# Altium project Embedded_System.PrjPcb
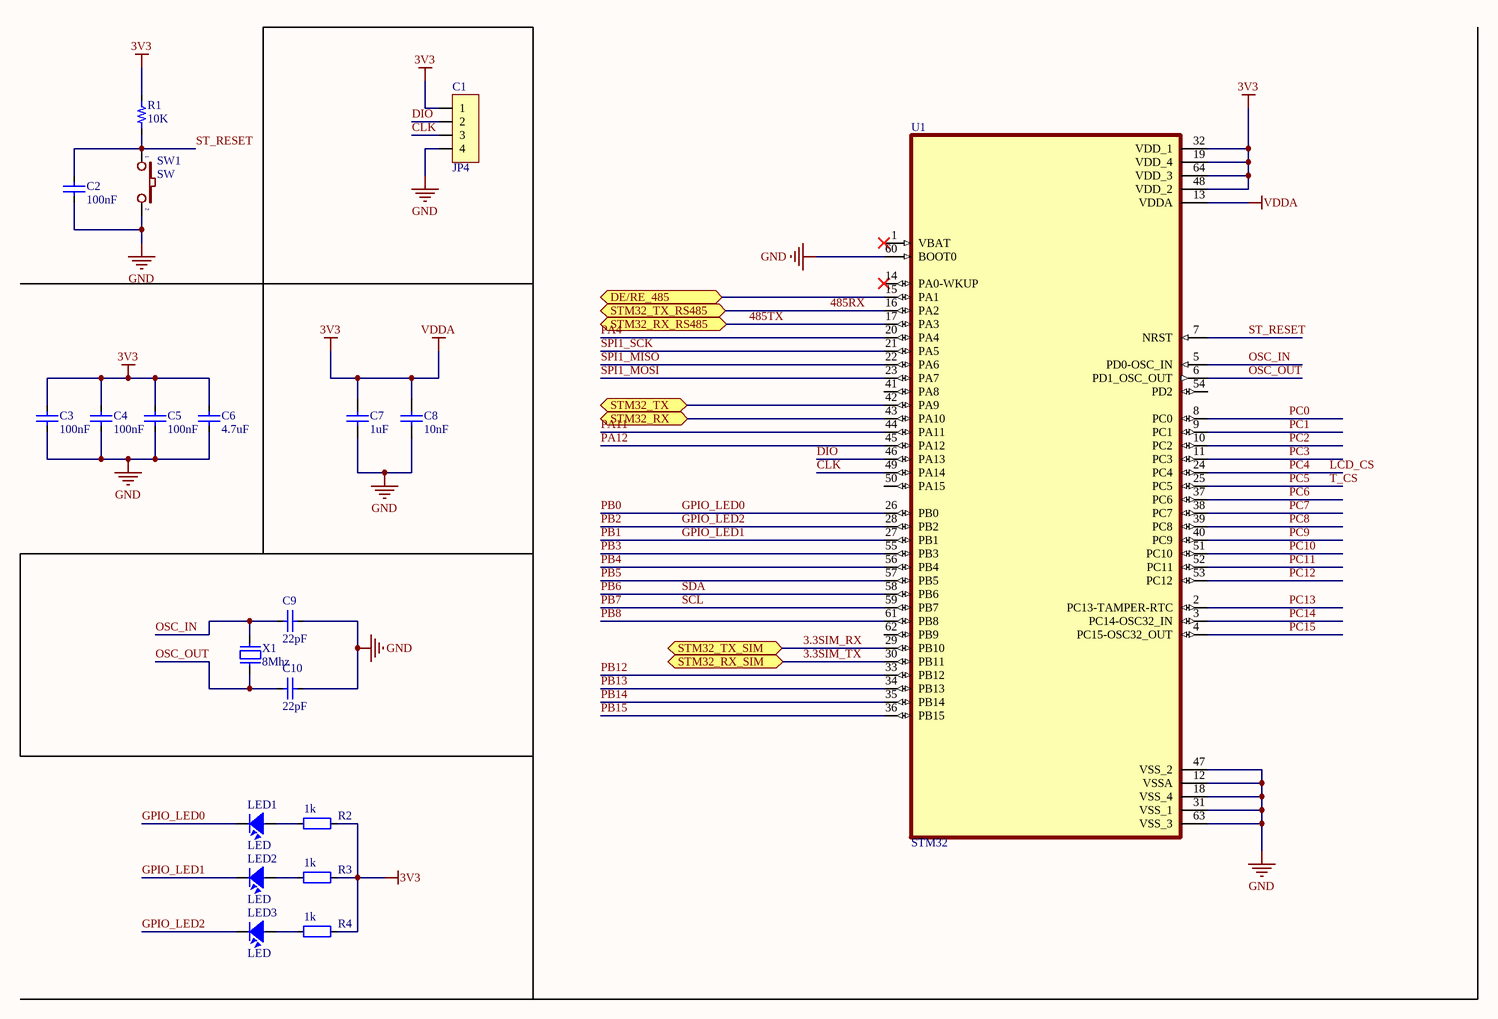
[diagram p0: STM32.SchDoc]
6 sheets, 109 parts. Net scope: flat (ports and power ports of the same name join across sheets).
Board file: Main.PcbDoc
Sheets:
  STM32.SchDoc
  POWER.SchDoc
  4G.SchDoc
  RS485.SchDoc
  LCD.SchDoc
  Sensor.SchDoc

## Sheet STM32.SchDoc
size A3; SheetNumber: 1; SheetTotal: 6

### Parts
C1  JP4  [JP4-C1T]
C2  100nF  [CAP_0805]
C3  100nF  [CAP_0805]
C4  100nF  [CAP_0805]
C5  100nF  [CAP_0805]
C6  4.7uF  [CAP_0805]
C7  1uF  [CAP_0805]
C8  10nF  [CAP_0805]
C9  22pF  [CAP_0805]
C10  22pF  [CAP_0805]
LED1  LED  [LED-0805-Red]
LED2  LED  [LED-0805-Green]
LED3  LED  [LED-0805-Blue]
R1  10K  [RES-SMD-0101]
R2  1k  [RES-SMD-0805]
R3  1k  [RES-SMD-0805]
R4  1k  [RES-SMD-0805]
SW1  SW  [SW2]
U1  STM32  [LQFP 64]
X1  8Mhz  [XT2]

### Ports
DE/RE_485 (bidir), STM32_RX (bidir), STM32_RX_RS485 (bidir), STM32_RX_SIM (bidir), STM32_TX (bidir), STM32_TX_RS485 (bidir), STM32_TX_SIM (bidir)

### Nets
3V3: C1.1 C3.2 C4.2 C5.2 C6.2 C7.2 C8.2 R1.1 R2.1 R3.1 R4.1 U1.13(VDDA) U1.19(VDD_4) U1.32(VDD_1) U1.48(VDD_2) U1.64(VDD_3)  [also labelled VDDA]
GND: C1.4 C2.2 C3.1 C4.1 C5.1 C6.1 C7.1 C8.1 C9.1 C10.1 SW1.2 U1.12(VSSA) U1.18(VSS_4) U1.31(VSS_1) U1.47(VSS_2) U1.60(BOOT0) U1.63(VSS_3)
3.3SIM_RX: U1.29(PB10) ; port STM32_TX_SIM
3.3SIM_TX: U1.30(PB11) ; port STM32_RX_SIM
485RX: U1.16(PA2) ; port STM32_TX_RS485
485TX: U1.17(PA3) ; port STM32_RX_RS485
CLK: C1.3 U1.49(PA14)
DIO: C1.2 U1.46(PA13)
GPIO_LED0: LED1.2 U1.26(PB0)  [also labelled PB0]
GPIO_LED1: LED2.2 U1.27(PB1)  [also labelled PB1]
GPIO_LED2: LED3.2 U1.28(PB2)  [also labelled PB2]
LCD_CS: U1.24(PC4)  [also labelled PC4]
OSC_IN: C9.2 U1.5(PD0-OSC_IN) X1.2
OSC_OUT: C10.2 U1.6(PD1_OSC_OUT) X1.1
PA4: U1.20(PA4)
PA11: U1.44(PA11)
PA12: U1.45(PA12)
PB3: U1.55(PB3)
PB4: U1.56(PB4)
PB5: U1.57(PB5)
PB6: U1.58(PB6)  [also labelled SDA]
PB7: U1.59(PB7)  [also labelled SCL]
PB8: U1.61(PB8)
PB12: U1.33(PB12)
PB13: U1.34(PB13)
PB14: U1.35(PB14)
PB15: U1.36(PB15)
PC0: U1.8(PC0)
PC1: U1.9(PC1)
PC2: U1.10(PC2)
PC3: U1.11(PC3)
PC5: U1.25(PC5)  [also labelled T_CS]
PC6: U1.37(PC6)
PC7: U1.38(PC7)
PC8: U1.39(PC8)
PC9: U1.40(PC9)
PC10: U1.51(PC10)
PC11: U1.52(PC11)
PC12: U1.53(PC12)
PC13: U1.2(PC13-TAMPER-RTC)
PC14: U1.3(PC14-OSC32_IN)
PC15: U1.4(PC15-OSC32_OUT)
SPI1_MISO: U1.22(PA6)
SPI1_MOSI: U1.23(PA7)
SPI1_SCK: U1.21(PA5)
ST_RESET: C2.1 R1.2 SW1.1 U1.7(NRST)
NetLED1_1: LED1.1 R2.2
NetLED2_1: LED2.1 R3.2
NetLED3_1: LED3.1 R4.2
NetU1_15: U1.15(PA1) ; port DE/RE_485
NetU1_42: U1.42(PA9) ; port STM32_TX
NetU1_43: U1.43(PA10) ; port STM32_RX

Not connected (* = marked no-connect by the designer): U1 1(VBAT)* 14(PA0-WKUP)* 41(PA8) 50(PA15) 54(PD2) 62(PB9)

### Library data of the parts
C1 = JP4: WR-PHD 2.54 mm Angled Socket Header; Manufacturer: W¨¹rth Elektronik eiSos GmbH; partNo: 613004143121; ComponentLink1 Description: Manufacturer; ComponentLink2 Description: Datasheet; NoPins: 04; Created Date: 29 March 2013; ComponentLink1URL: http://www.we-online.com; ComponentLink2URL: http://katalog.we-online.de/em/datasheet/6130xx143121.pdf; Created by: Karrer Zheng
C2-C10 = CapSMD: Capacitor; Value: 33p; Published: 8-Jun-2000; LatestRevisionDate: 17-Jul-2002; LatestRevisionNote: Re-released for DXP Platform.; PackageReference: RAD-0.3; Publisher: Altium Limited
LED1-LED3 = LED: LED Single colour Green and Red; Value: LED 3 ly Single Colour
R1-R4 = Resistor - SMD: Resistor; Manufacturer: Generic Components; Class: Passive; Published: 08/06/2000; Publisher: Altium Hobart Technology Centre
SW1 = SW2: Switch button 2 pin; Value: SW chip 2 pin
U1 = STM32F103RCT6: STM32 ARM-based 32-bit MCU 72MHz 256KB
X1 = XT2: Crystal For all Crystal 2pin.; Value: 4Mhz

## Sheet POWER.SchDoc
size A3; SheetNumber: 2; SheetTotal: 6
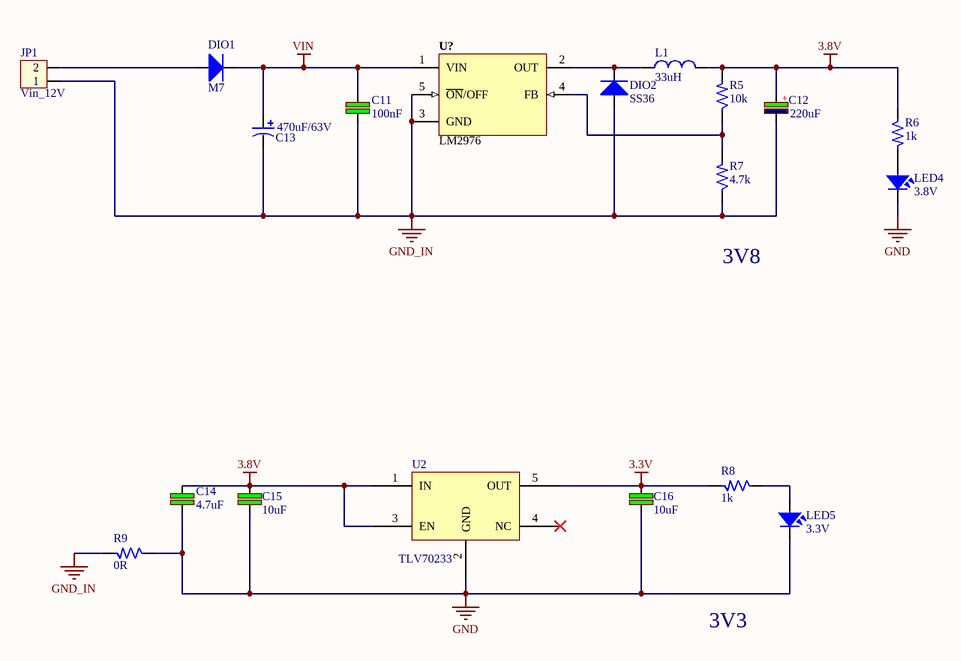
[diagram p1: POWER.SchDoc]

### Parts
C11  value 100nF  [C-0805]  (hidden comment: 4.7uF)
C12  220uF  [EEFSDE]
C13  470uF/63V  [CAP_7343]
C14  4.7uF  [C-0805]
C15  10uF  [C-0805]
C16  10uF  [C-0805]
DIO1  M7  [DIO-214AC(SMA)]
DIO2  SS36  [DIO-214AC(SMA)]
JP1  Vin_12V  [KF2-5.08]
L1  33uH  [L-SMD-M-7.3x4.5]
LED4  3.8V  [LED-0805-Blue]
LED5  3.3V  [LED-0805-Blue]
R5  10k  [R-0805]
R6  1k  [R-0805]
R7  4.7k  [R-0805]
R8  1k  [R-0805]
R9  0R  [R-0805]
U2  Name: TLV70233  [SOT23-5]  (hidden comment: TLV70223)
U?  LM2976  [TO263-5]

### Nets
3.3V: C16.1 R8.2 U2.5(OUT)  [project net +3.3V]
3.8V: C12.1 C14.2 C15.1 L1.2 R5.2 R6.1 U2.1(IN) U2.3(EN)
GND: C14.1 C15.2 C16.2 LED4.2 LED5.2 R9.1 U2.2(GND)
GND_IN: C11.1 C12.2 C13.2 DIO2.1(A) JP1.1 R7.1 R9.2 U?.3(GND) U?.5(~{ON}/OFF)
VIN: C11.2 C13.1 DIO1.2(K) U?.1(VIN)
NetDIO1_1: DIO1.1(A) JP1.2
NetDIO2_2: DIO2.2(K) L1.1 U?.2(OUT)
NetLED4_1: LED4.1 R6.2
NetLED5_1: LED5.1 R8.1
NetR5_1: R5.1 R7.2 U?.4(FB)

Not connected (* = marked no-connect by the designer): U2 4(NC)*

### Notes on the sheet
- 3V8
- 3V3
- (in symbol CP5) +

### Library data of the parts
C11 C14 = C: 4.7µF ±10% 35V Ceramic Capacitor X5R 0805 (2012 Metric); Manufacturer: Samsung Electro-Mechanics; Part number: CL21A475KLCLQNC; User_Description: CAP CER 4.7UF 35V X5R 0805; Category: CAPACITOR; Package: 0805
  C14: Value: 4.7uF
C12 = CP5: 220µF Molded Tantalum Polymer Capacitor 16V 2917 (7343 Metric) 40mOhm @ 100kHz; Manufacturer: AVX Corporation; Part number: TCME227M016R0040E; User_Description: CAP TANT POLY 220UF 16V 2917; Value: 220uF; Category: CAPACITOR; Package: 2917
C13 = CAP_TAN_SMD: Polazied Tantalum Capacitor
C15 C16 = C: Cap SMD; Manufacturer: Samsung Electro-Mechanics; Part number: CL21A106KPFNNNG; User_Description: CAP CER 10UF 10V X5R 0805; Value: 10uF; Category: CAPACITOR; Package: 0805
DIO1 DIO2 = Diode SMD: Default Diode; Code - JEDEC: DO-214-AB; Value: 1N5007; Published: 8-Jun-2000; Revision: July-2002: Re-released for DXP Platform.; Publisher: Altium Limited
JP1 = Con2: Connector 2; Value: Connector 2
L1 = Inductor: https://linhkien.cxt.vn/6932-cuon-cam-cd74-cac-gia-tri.html; Value: 150 mH
LED4 LED5 = LED: as LED1 on sheet STM32
R5 = R: RES SMD 10K OHM 1% 1/8W 0805; Manufacturer: Yageo; Part number: RC0805FR-0710KL; Category: RESISTORS; Package: 0805; User_Description: RES SMD 10K OHM 1% 1/8W 0805; Value: 10k
R6 R8 = R: Resistor 1/4W; Manufacturer: Yageo; Part number: RC0805FR-071KL; User_Description: RES SMD 1K OHM 1% 1/8W 0805; Value: 1k; Category: RESISTORS; Package: 0805
R7 = R: RES SMD 3.3K OHM 1% 1/8W 0805; Manufacturer: Yageo; Part number: RC0805FR-073K3L; Category: RESISTORS; Package: 0805; User_Description: RES SMD 3.3K OHM 1% 1/8W 0805; Value: 3.3k
R9 = R: Resistor 1/4W; Manufacturer: Yageo; Part number: RC0805FR-071KL; Value: 1k; User_Description: RES SMD 1K OHM 1% 1/8W 0805; Category: RESISTORS; Package: 0805
U2 = TLV70223: IC æn ¸p TLV70233, d¸n; Package: SOT23-5
U? = LM2596: Max Input Voltage: 12 V; Max Output Current: 3 (6.0 peak) A; Max Output Voltage: mV; Category: IC-Power; Min Input Voltage: mV; Min Output Voltage: mV; Mounting Technology: Surface Mount; Status: Unreleased; Supply Voltage: mV; Temperature Range: -40 to +125 degC

## Sheet 4G.SchDoc
size A3; SheetNumber: 3; SheetTotal: 6
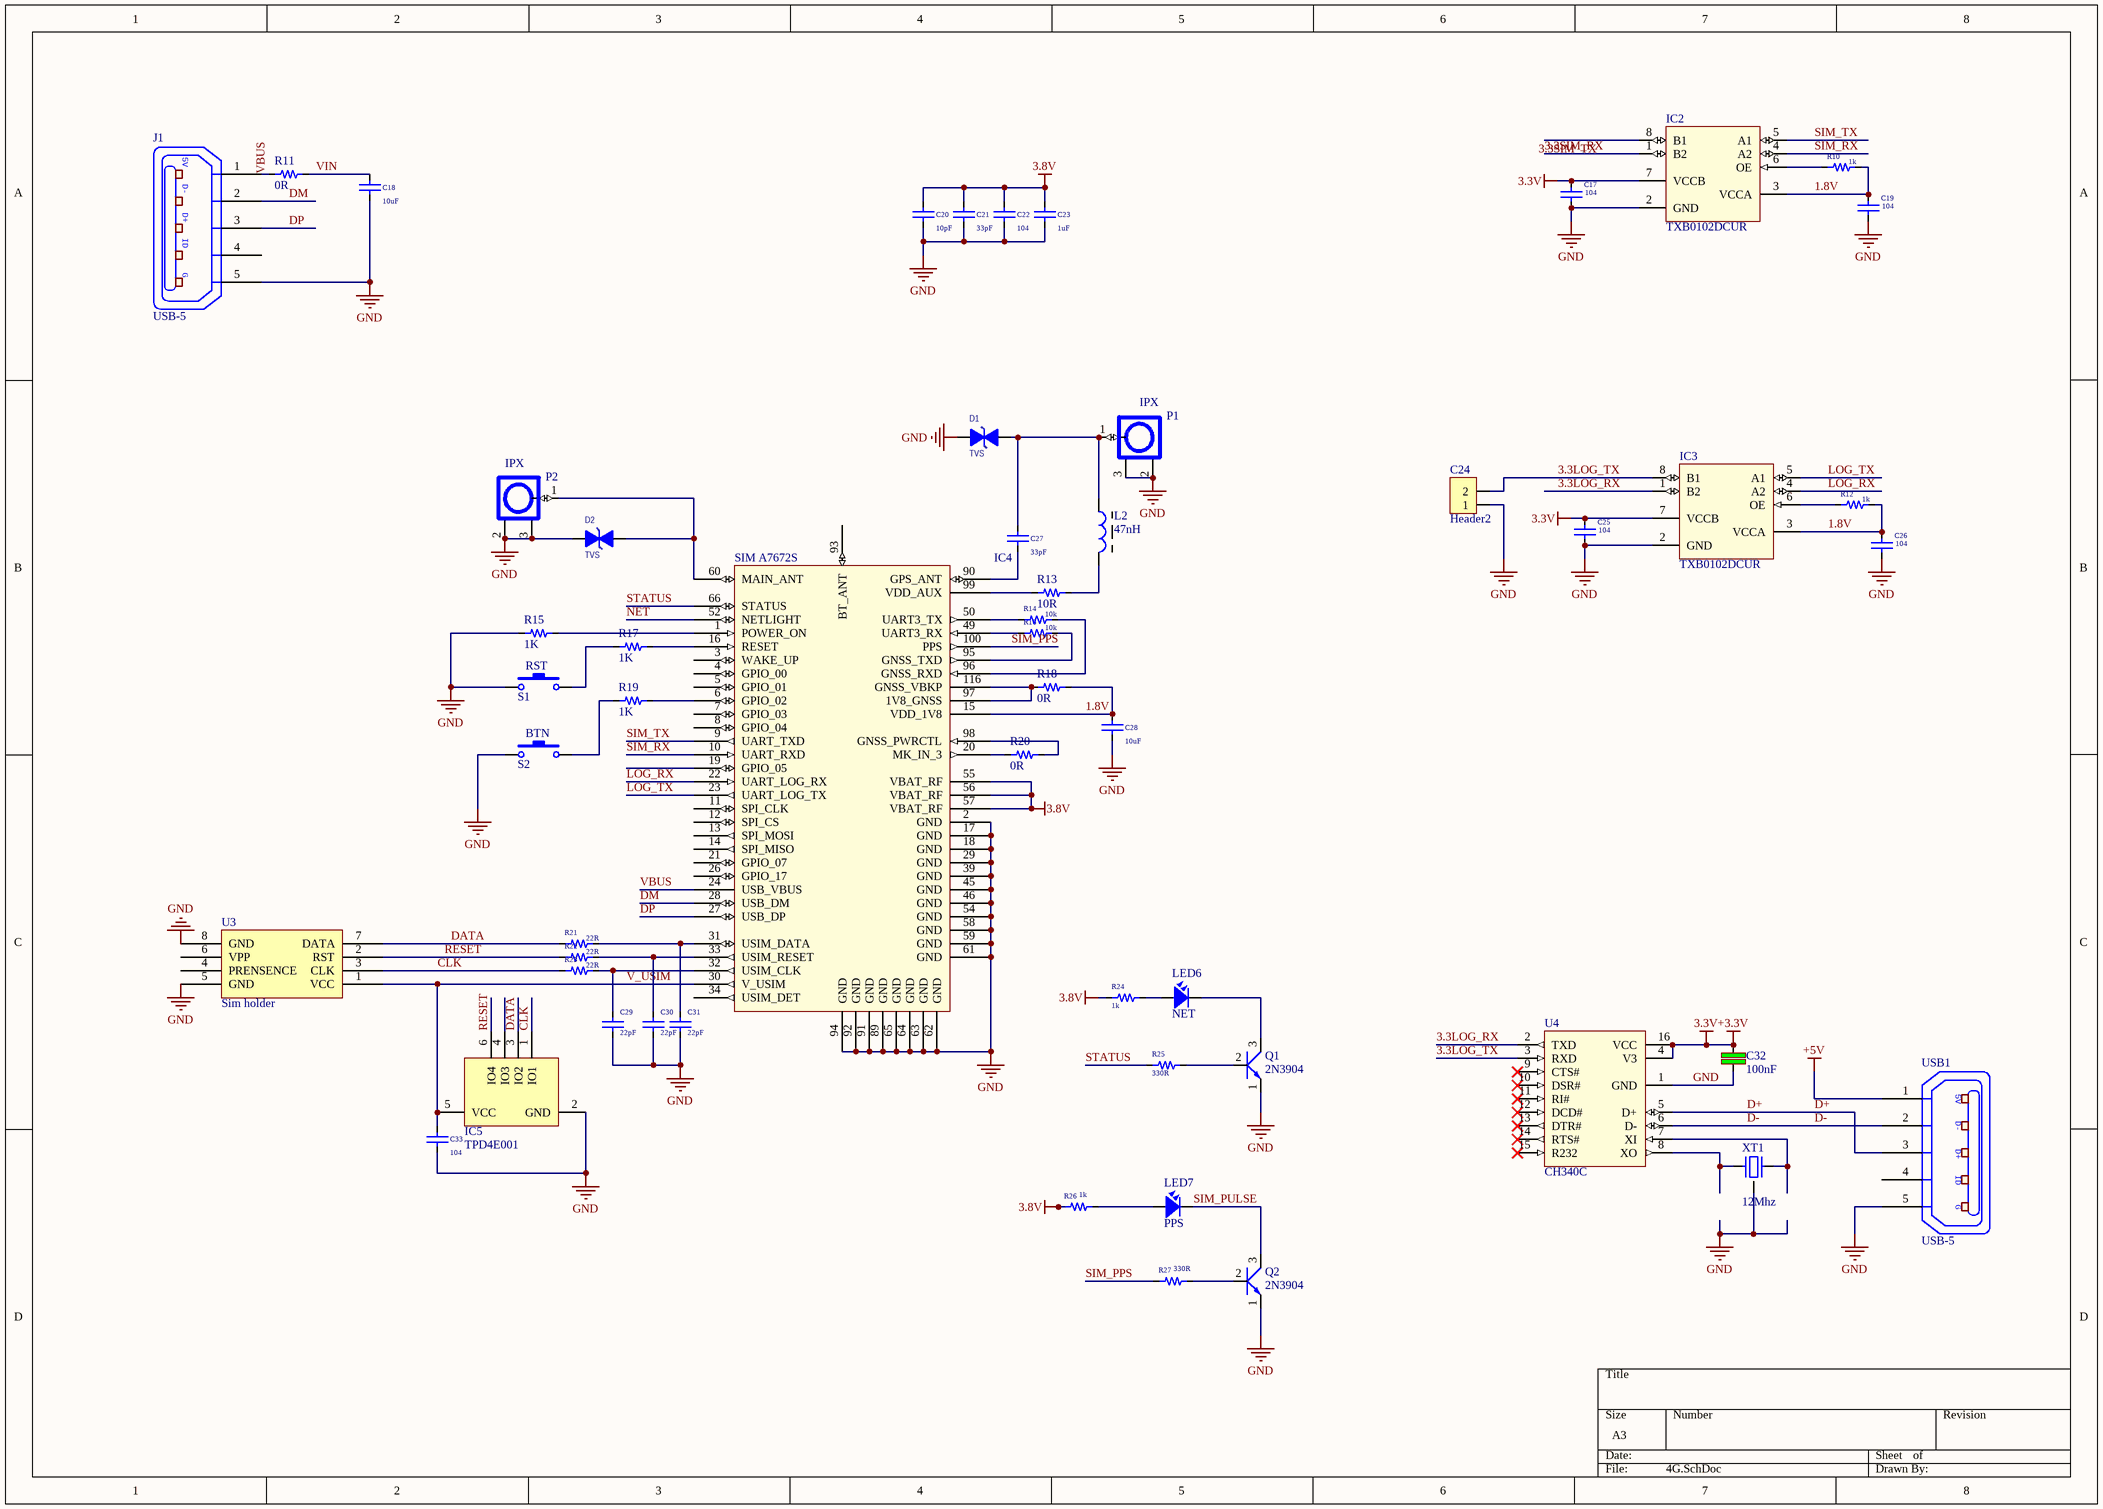
[diagram p2: 4G.SchDoc]

### Parts
C17  104  [CAP_0603]
C18  10uF  [CAP_0603]
C19  104  [CAP_0603]
C20  10pF  [CAP_0603]
C21  33pF  [CAP_0603]
C22  104  [CAP_0603]
C23  1uF  [CAP_0603]
C24  Header2  [JP2]
C25  104  [CAP_0603]
C26  104  [CAP_0603]
C27  33pF  [CAP_0603]
C28  10uF  [CAP_0603]
C29  22pF  [CAP_0603]
C30  22pF  [CAP_0603]
C31  22pF  [CAP_0603]
C32  100nF  [C-0805]
C33  104  [CAP_0603]
D1  TVS  [RES-SMD-0402]
D2  TVS  [RES-SMD-0402]
IC2  TXB0102DCUR  [TXB0102DCUR]
IC3  TXB0102DCUR  [TXB0102DCUR]
IC4  SIM A7672S  [A7672S]
IC5  TPD4E001  [TPD4E001]
J1  USB-5  [USB-M1]
L2  47nH  [RES-SMD-0603]
LED6  NET  [LED-0805-Blue]
LED7  PPS  [LED-0805-Blue]
P1  IPX  [IPXS]
P2  IPX  [IPXS]
Q1  2N3904  [SOT23C]
Q2  2N3904  [SOT23C]
R10  1k  [RES-SMD-0603]
R11  0R  [RES-SMD-0603]
R12  1k  [RES-SMD-0603]
R13  10R  [RES-SMD-0603]
R14  10k  [RES-SMD-0603]
R15  1K  [RES-SMD-0603]
R16  10k  [RES-SMD-0603]
R17  1K  [RES-SMD-0603]
R18  0R  [RES-SMD-0603]
R19  1K  [RES-SMD-0603]
R20  0R  [RES-SMD-0603]
R21  22R  [RES-SMD-0603]
R22  22R  [RES-SMD-0603]
R23  22R  [RES-SMD-0603]
R24  1k  [RES-SMD-0603]
R25  330R  [RES-SMD-0603]
R26  1k  [RES-SMD-0603]
R27  330R  [RES-SMD-0603]
S1  RST  [SW-SMD]
S2  BTN  [SW-SMD]
U3  Sim holder  [sim_holder_micro]
U4  CH340C  [SOP-16]
USB1  USB-5  [USB-M1]
XT1  12Mhz  [XT32-3]

### Nets
3.8V: C20.2 C21.2 C22.2 C23.2 IC4.55(VBAT_RF) IC4.56(VBAT_RF) IC4.57(VBAT_RF) R24.2 R26.2
+3.3V: C17.2 C25.2 C32.2 IC2.7(VCCB) IC3.7(VCCB) U4.4(V3) U4.16(VCC)  [also labelled 3.3V]
+5V: USB1.1(P1)
GND: C17.1 C18.1 C19.1 C20.1 C21.1 C22.1 C23.1 C24.1 C25.1 C26.1 C28.1 C29.1 C30.1 C31.1 C32.1 C33.1 D1.2(K) D2.2(K) IC2.2(GND) IC3.2(GND) IC4.2(GND) IC4.17(GND) IC4.18(GND) IC4.29(KEYPAD_0) IC4.39(GND) IC4.45(GND) IC4.46(ADC2) IC4.54(GPIO4) IC4.58(GND) IC4.59(GND) IC4.61(GND) IC4.62(GND) IC4.63(GND) IC4.64(GND) IC4.65(GND) IC4.89(GND) IC4.91(GND) IC4.92(GND) IC4.94(GND) IC5.2(GND) J1.5(P5) P1.2 P1.3 P2.2 P2.3 Q1.1(E) Q2.1(E) R15.1 S1.1 S2.1 U3.5(GND) U3.8(GND) U4.1(GND) USB1.5(P5) XT1.3
1.8V: C19.2 C26.2 C28.2 IC2.3(VCCA) IC3.3(VCCA) IC4.15(RESERVED) R10.1 R12.1 R18.2
3.3LOG_RX: IC3.1(B2) U4.2(TXD)
3.3LOG_TX: C24.2 IC3.8(B1) U4.3(RXD)
3.3SIM_RX: IC2.1(B2)
3.3SIM_TX: IC2.8(B1)
CLK: IC5.1(IO1) R23.2 U3.3(CLK)
D+: U4.5(D+) USB1.3(P3)
D-: U4.6(D-) USB1.2(P2)
DATA: IC5.3(IO2) R21.2 U3.7(DATA)
DM: IC4.28(KEYSENSE_N0) J1.2(P2)
DP: IC4.27(KEYSENSE_N1) J1.3(P3)
LOG_RX: IC3.4(A2) IC4.22(SPK_P)
LOG_TX: IC3.5(A1) IC4.23(MIC1P)
NET: IC4.52(GPIO41)
RESET: IC5.6(IO4) R22.2 U3.2(RST)
SIM_PPS: IC4.100(PPS) R27.2
SIM_PULSE: LED7.2 Q2.3(C)
SIM_RX: IC2.4(A2) IC4.10(UART_RXD)
SIM_TX: IC2.5(A1) IC4.9(UART_TXD)
STATUS: IC4.66(STATUS) R25.2
V_USIM: C33.2 IC4.30(KEYPAD_2) IC5.5(VCC) U3.1(VCC)
VBUS: IC4.24(MIC1N) J1.1(P1) R11.1
VIN: C18.2 R11.2
NetC27_1: C27.1 IC4.90(GPS_ANT)
NetC27_2: C27.2 D1.1(A) L2.1 P1.1
NetC29_2: C29.2 IC4.32(KEYSENSE_N3) R23.1
NetC30_2: C30.2 IC4.33(KEYPAD_1) R22.1
NetC31_2: C31.2 IC4.31(KEYSENSE_N2) R21.1
NetD2_1: D2.1(A) IC4.60(MAIN_ANT) P2.1
NetIC2_6: IC2.6(OE) R10.2
NetIC3_6: IC3.6(OE) R12.2
NetIC4_1: IC4.1(POWER_ON) R15.2
NetIC4_6: IC4.6(GPIO_02) R19.1
NetIC4_16: IC4.16(RESERVED) R17.2
NetIC4_20: IC4.20(MK_IN_3) R20.1
NetIC4_49: IC4.49(GPIO40) R16.2
NetIC4_50: IC4.50(GPIO43) R14.2
NetIC4_95: IC4.95(GNSS_TXD) R16.1
NetIC4_96: IC4.96(GNSS_RXD) R14.1
NetIC4_97: IC4.97(1V8_GNSS) IC4.116(GNSS_VBKP) R18.1
NetIC4_98: IC4.98(GNSS_PWRCTL) R20.2
NetIC4_99: IC4.99(VDD_AUX) R13.1
NetL2_2: L2.2 R13.2
NetLED6_1: LED6.1 R24.1
NetLED6_2: LED6.2 Q1.3(C)
NetLED7_1: LED7.1 R26.1
NetQ1_2: Q1.2(B) R25.1
NetQ2_2: Q2.2(B) R27.1
NetR17_1: R17.1 S1.2
NetR19_2: R19.2 S2.2
NetU4_7: U4.7(XI) XT1.2
NetU4_8: U4.8(XO) XT1.1

Not connected (* = marked no-connect by the designer): IC4 3(WAKE_UP) 4(GPIO_00) 5(GPIO_01) 7(GPIO_03) 8(GPIO_04) 11(SPI_CLK) 12(SPI_CS) 13(SPI_MOSI) 14(SPI_MISO) 19(GPIO_05) 21(SPK_M) 25(EAR1N) 26(EAR1P) 34(KEYPAD_4) 35(KEYPAD_3) 36(KEYSENSE_N4) 47(ADC1) 48(GPIO44) 51(GPIO1) 53(GPIO42) 73(PCM_DOUT) 74(PCM_DIN) 75(PCM_SYNC) 76(PCM_CLK) 93(BT_ANT); IC5 4(IO3); J1 4(P4); U3 4(PRENSENCE) 6(VPP); U4 9(CTS#)* 10(DSR#)* 11(RI#)* 12(DCD#)* 13(DTR#)* 14(RTS#)* 15(R232)*; USB1 4(P4)

### Notes on the sheet
- (in symbol USB-5) 5V; D-; D+; ID; G

### Library data of the parts
C17-C23 C25-C31 C33 = CapSMD: Capacitor; Value: 33p; Published: 8-Jun-2000; LatestRevisionDate: 17-Jul-2002; LatestRevisionNote: Re-released for DXP Platform.; PackageReference: RAD-0.3; Publisher: Altium Limited
C24 = Header2: Header IDC, 2 x 1 Pin Vertical 2.54mm Pitch (Non-Boxed, Male); Manufacturer: W¨¹rth Elektronik eiSos GmbH; partNo: 613002143121; ComponentLink1 Description: Manufacturer; ComponentLink2 Description: Datasheet; NoPins: 02; Created Date: 29 March 2013; ComponentLink1URL: http://www.we-online.com; ComponentLink2URL: http://katalog.we-online.de/em/datasheet/6130xx143121.pdf; Created by: Karrer Zheng
C32 = C: Cap SMD; Manufacturer: Samsung Electro-Mechanics; Part number: CL21B104KBCNNWC; User_Description: CAP CER 0.1UF 50V X7R 0805; Value: 100nF; Category: CAPACITOR; Package: 0805
D1 D2 = TVS: TVS DIODE 4VWM 1005; Manufacturer: Murata Electronics; Part number: LXES15AAA1-153; Value: 4V; Category: Circuit Protection; Package: 0402; User_Description: TVS DIODE 4VWM 1005
IC2 IC3 = TXB0102DCUR: IC TRNSLTR BIDIRECTIONAL US8; Manufacturer: Texas Instruments; Category: IC Logic Level; Package: 8-VSSOP; Part number: TXB0102DCUR; User_Description: IC TRNSLTR BIDIRECTIONAL US8
IC4 = SIM A7672S: SIM A7672S-CAT-M1; Part number: SIM A7672S
IC5 = TPD4E001_1: Manufacturer: Texas Instruments; Part number: TPD4E001RDBVR; User_Description: TVS DIODE 5.5VWM SC70-6; Category: Circuit Protection; Package: SOT-363
J1 USB1 = USB-5: Manufacturer: FCI; Category: Connectors, Interconnects
L2 = Inductor Ferit: FIXED IND 47NH 300MA 700MOHM SMD; Manufacturer: Taiyo Yuden; Part number: HK160847NJ-T; Value: 150 mH; Category: INDUCTORS; Package: 0603; User_Description: FIXED IND 47NH 300MA 700MOHM SMD
LED6 LED7 = LED: as LED1 on sheet STM32
P1 P2 = IPXSx66: Antenna GSM GPS; Manufacturer: TE Connectivity AMP Connectors; Part number: 2334884-1; User_Description: UMCC MICRO-COAX RECEPTACLE, GEN; Category: Connectors; Package: SMD
Q1 Q2 = 2N904: NPN 600mW, ECB; Value: C1815
R10-R27 = Resistor - SMD: as R1 on sheet STM32; Published: 08/06/2000; Publisher: Altium Hobart Technology Centre
S1 S2 = SW-SMD: Switch; Published: 24-Mar-1999; LatestRevisionDate: 17-Jul-2002; LatestRevisionNote: Re-released for DXP Platform.; PackageReference: SPST-2; Publisher: Altium Limited
U3 = Component_1
U4 = CH340G: USB to UART Interface; Manufacturer: WCH; Category: IC UART Interface; Package: SOIC-16; Part number: CH340G; User_Description: USB to UART Interface
XT1 = XT32k: Crystal 32,768kHz for timer real; Value: 32,768khz

## Sheet RS485.SchDoc
size A3; SheetNumber: 4; SheetTotal: 6
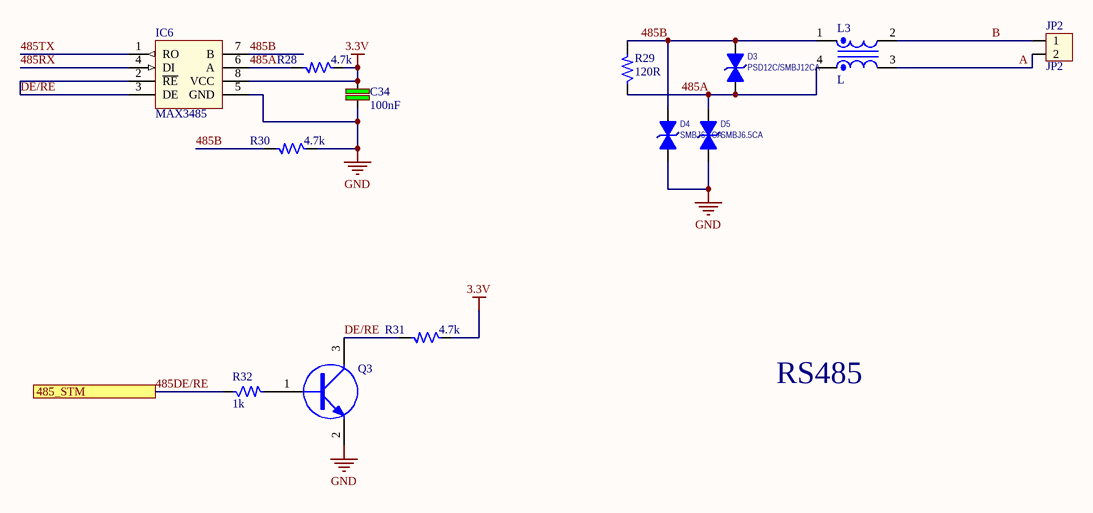
[diagram p3: RS485.SchDoc]

### Parts
C34  100nF  [C-0805]
D3  PSD12C/SMBJ12CA  [SOD323 - DO241]
D4  SMBJ6.5CA  [TVS]
D5  SMBJ6.5CA  [TVS]
IC6  MAX3485  [SOIC-8]
JP2  JP2  [KF2-5.08]
L3  L  [CMC 51UH 800MA 2LN SMD AEC-Q200]
Q3  C1815(MMBT4401)  [SOT23]  (value not drawn)
R28  4.7k  [R-0805]
R29  120R  [R-0805]
R30  4.7k  [R-0805]
R31  4.7k  [R-0805]
R32  1k  [R-0805]

### Ports
485_STM

### Nets
3.3V: C34.1 IC6.8(VCC) R28.1 R31.1  [project net +3.3V]
GND: C34.2 D4.1(A) D5.1(A) IC6.5(GND) Q3.2(E) R30.1
485A: D3.1(A) D5.2(K) IC6.6(A) L3.4 R28.2 R29.1
485B: D3.2(K) D4.2(K) IC6.7(B) L3.1 R29.2 R30.2
485DE/RE: R32.1 ; port 485_STM
485RX: IC6.4(DI)
485TX: IC6.1(RO)
A: JP2.2 L3.3
B: JP2.1 L3.2
DE/RE: IC6.2(~{RE}) IC6.3(DE) Q3.3(C) R31.2
NetQ3_1: Q3.1(B) R32.2

### Notes on the sheet
- RS485

### Library data of the parts
C34 = C: as C32 on sheet 4G; Value: 100nF; Category: CAPACITOR; Package: 0805
D3-D5 = SMAJ30CA-30V/8.3A: TVS DIODE 30VWM 48.4VC SMA; Manufacturer: Bourns Inc.; Part number: PSD12C; Category: Circuit Protection; Package: SOD323; User_Description: TVS DIODE 30VWM 48.4VC SMA
IC6 = MAX3362EKA+T: IC TRANSCEIVER HALF 1/1 SOT23-8; Manufacturer: Maxim Integrated; Category: Interface - Drivers; Package: SOT-23-8; User_Description: IC TRANSCEIVER HALF 1/1 SOT23-8; Part number: MAX3362EKA+T
JP2 = Con2: Connector 2; Value: Connector 2
L3 = L filter Common Mode Chokes: CMC 51UH 800MA 2LN SMD AEC-Q200; Manufacturer: EPCOS - TDK Electronics; Part number: B82793S0513N201; User_Description: CMC 51UH 800MA 2LN SMD AEC-Q200
Q3 = NPN: Transistor C1815, SOT23; Manufacturer: Fairchild Semiconductor; User_Description: 0.6A, 40V, NPN; Category: TRAN NPN; Package: SOT-23; Part number: MMBT4401
R28 R30 R31 = R: RES SMD 4.7K OHM 1% 1/8W 0805; Manufacturer: Yageo; Part number: RC0805FR-074K7L; Category: RESISTORS; Package: 0805; User_Description: RES SMD 4.7K OHM 1% 1/8W 0805; Value: 4.7k
R29 = R: Resistor 1/4W; Manufacturer: Yageo; Part number: RC0805FR-07120RL; User_Description: RES SMD 120 OHM 1% 1/8W 0805; Category: RESISTORS; Package: 0805; Value: 120R
R32 = R: as R6 on sheet POWER; Category: RESISTORS; Package: 0805; Value: 1k

## Sheet LCD.SchDoc
size A3; SheetNumber: 5; SheetTotal: 6
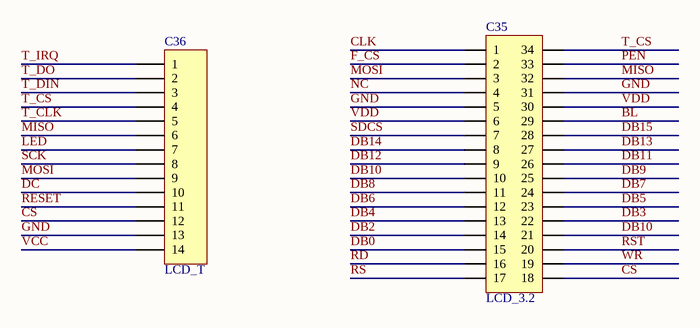
[diagram p4: LCD.SchDoc]

### Parts
C35  LCD_3.2  [JP17-C2T]
C36  LCD_T  [JP14-C1T]

### Nets
BL: C35.29
CLK: C35.1
CS: C35.18 C36.12
DB0: C35.15
DB2: C35.14
DB3: C35.22
DB4: C35.13
DB5: C35.23
DB6: C35.12
DB7: C35.24
DB8: C35.11
DB9: C35.25
DB10: C35.10 C35.21
DB11: C35.26
DB12: C35.9
DB13: C35.27
DB14: C35.8
DB15: C35.28
DC: C36.10
F_CS: C35.2
GND: C35.5 C35.31 C36.13
LED: C36.7
MISO: C35.32 C36.6
MOSI: C35.3 C36.9
NC: C35.4
PEN: C35.33
RD: C35.16
RESET: C36.11
RS: C35.17
RST: C35.20
SCK: C36.8
SDCS: C35.7
T_CLK: C36.5
T_CS: C35.34 C36.4
T_DIN: C36.3
T_DO: C36.2
T_IRQ: C36.1
VCC: C36.14
VDD: C35.6 C35.30
WR: C35.19

### Library data of the parts
C35 = JP17x2: WR-PHD 2.54 mm Dual Socket Header; Manufacturer: W¨¹rth Elektronik eiSos GmbH; partNo: 61303421821; ComponentLink1 Description: Manufacturer; ComponentLink2 Description: Datasheet; NoPins: 34; Created Date: 29 March 2013; ComponentLink1URL: http://www.we-online.com; ComponentLink2URL: http://katalog.we-online.de/em/datasheet/6130xx21821.pdf; Created by: Karrer Zheng
C36 = JP14: WR-PHD 2.54 mm Angled Socket Header; Manufacturer: W¨¹rth Elektronik eiSos GmbH; partNo: 613014143121; ComponentLink1 Description: Manufacturer; ComponentLink2 Description: Datasheet; NoPins: 14; Created Date: 29 March 2013; ComponentLink1URL: http://www.we-online.com; ComponentLink2URL: http://katalog.we-online.de/em/datasheet/6130xx143121.pdf; Created by: Karrer Zheng

## Sheet Sensor.SchDoc
size A3; SheetNumber: 6; SheetTotal: 6

## Nets that join several sheets
3.8V: POWER (8 pins), 4G (9 pins)
+3.3V: POWER (C16.1 R8.2 U2.5), 4G (7 pins), RS485 (C34.1 IC6.8 R28.1 R31.1)
GND: STM32 (17 pins), POWER (7 pins), 4G (55 pins), RS485 (6 pins)